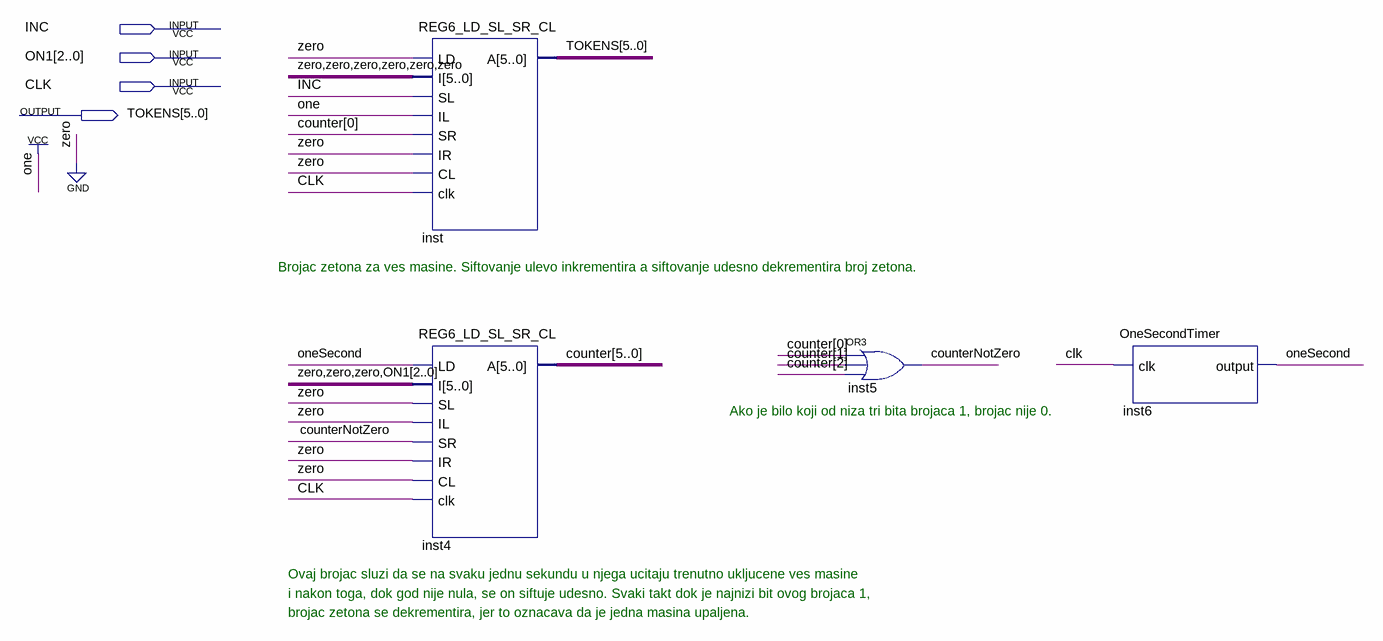
[diagram p0: schematic sheet]
// Quartus schematic zadatak2.bdf as structural Verilog: 4 symbols, 4 pins
module zadatak2 (
  input  INC,
  input  [2:0] ON1,
  input  CLK,
  output [5:0] TOKENS
);

  wire counterNotZero, oneSecond;
  wire [5:0] counter;

  REG6_LD_SL_SR_CL inst (
    .LD(1'b0), .I({6{1'b0}}), .SL(INC), .IL(1'b1), .SR(counter[0]), .IR(1'b0), .CL(1'b0), .clk(CLK),
    .A(TOKENS));
  REG6_LD_SL_SR_CL inst4 (
    .LD(oneSecond), .I({3'b000, ON1}), .SL(1'b0), .IL(1'b0), .SR(counterNotZero), .IR(1'b0), .CL(1'b0),
    .clk(CLK), .A(counter));
  or inst5 (counterNotZero, counter[0], counter[1], counter[2]);
  OneSecondTimer inst6 (.clk(CLK), .\output (oneSecond));

  // Notes on the sheet:
  //   Brojac zetona za ves masine. Siftovanje ulevo inkrementira a siftovanje udesno dekrementira broj zetona.
  //   Ako je bilo koji od niza tri bita brojaca 1, brojac nije 0.
  //   Ovaj brojac sluzi da se na svaku jednu sekundu u njega ucitaju trenutno ukljucene ves masine
  //   i nakon toga, dok god nije nula, se on siftuje udesno. Svaki takt dok je najnizi bit ovog brojaca 1,
  //   brojac zetona se dekrementira, jer to oznacava da je jedna masina upaljena.
endmodule
